# EAGLE design TrackerMini_V2 (EAGLE 9.6.2)
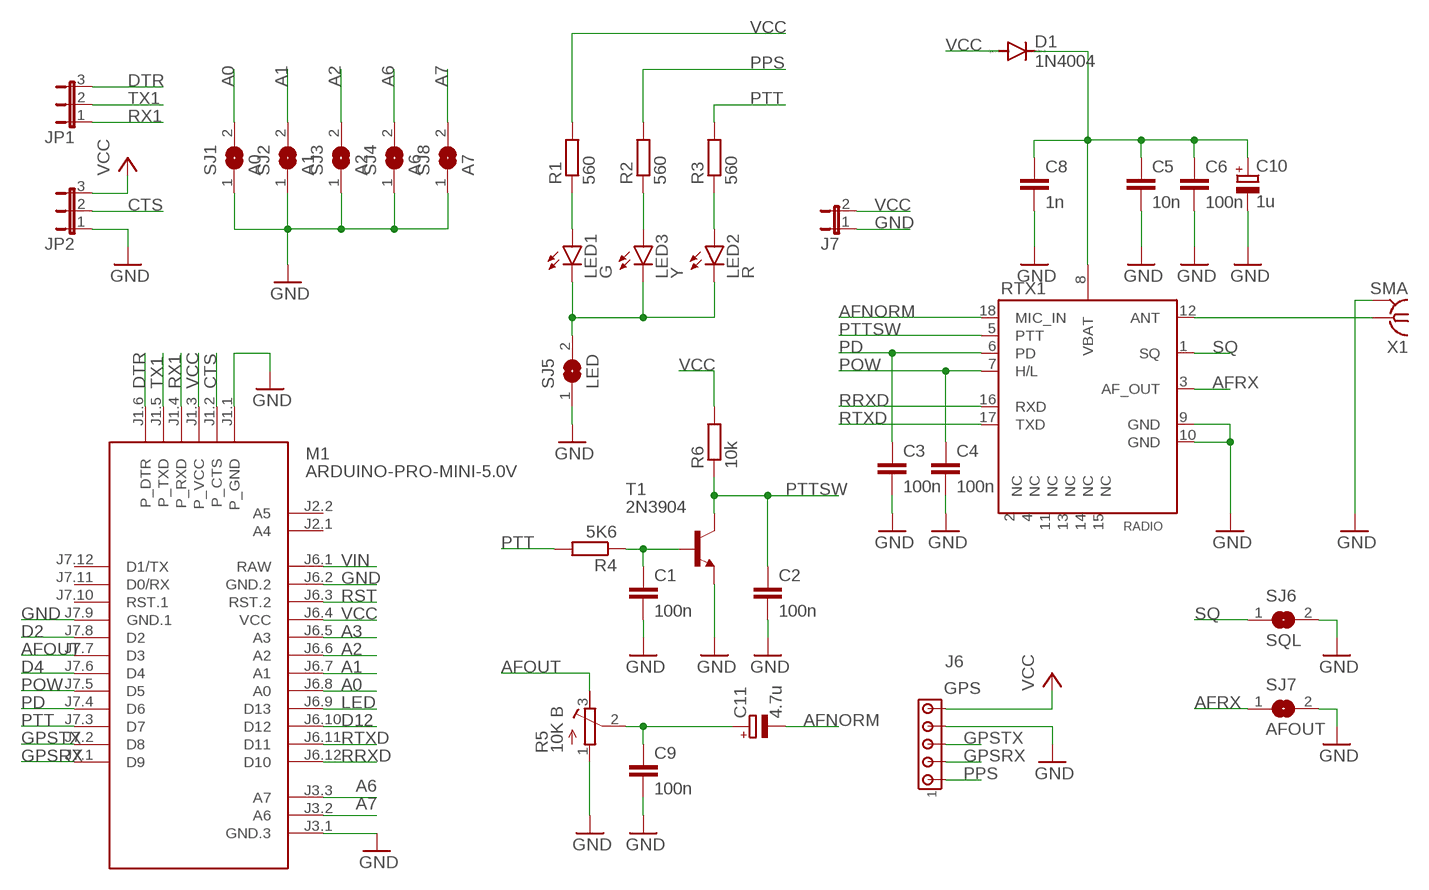
[diagram p0: schematic, sheet 1]

## Parts
C1  100n  C-EU025-025X050  [C025-025X050]
C2  100n  C-EU025-025X050  [C025-025X050]
C3  100n  C-EU025-025X050  [C025-025X050]
C4  100n  C-EU025-025X050  [C025-025X050]
C5  10n  C-EU025-025X050  [C025-025X050]
C6  100n  C-EU025-025X050  [C025-025X050]
C8  1n  C-EU025-025X050  [C025-025X050]
C9  100n  C-EU025-025X050  [C025-025X050]
C10  1u  CPOL-EUE2-5  [E2-5]
C11  4.7u  CPOL-EUE2-5  [E2-5]
D1  1N4004  [DO41-10]
J6  GPS  MTA05-100  [10X05MTA]
J7  JP1E  [JP1]
JP1  JP2E  [JP2]
JP2  JP2E  [JP2]
LED1  G  TLLG4400  [LED3MM]
LED2  R  TLLR4400  [LED3MM]
LED3  Y  TLLY4400  [LED3MM]
M1  ARDUINO-PRO-MINI-5.0V  [ARDUINO-PRO-MINI]
R1  560  R-EU_0204/7  [0204/7]
R2  560  R-EU_0204/7  [0204/7]
R3  560  R-EU_0204/7  [0204/7]
R4  5K6  R-EU_0204/7  [0204/7]
R5  10K B  R-TRIMM64W  [RTRIM64W]
R6  10k  R-EU_0204/7  [0204/7]
RTX1  RADIO  DRA818A  [DRA818A]
SJ1  A0  SJ  [SJ]
SJ2  A1  SJ  [SJ]
SJ3  A2  SJ  [SJ]
SJ4  A6  SJ  [SJ]
SJ5  LED  SJ  [SJ]
SJ6  SQL  SJW  [SJW]
SJ7  AFOUT  SJW  [SJW]
SJ8  A7  SJ  [SJ]
T1  2N3904  [TO92]
X1  SMA  SMA-142-0701-801/806  [J502-ND-142-0701-801/806]

## Nets
A0: M1.J6.8(A0) SJ1.2
A1: M1.J6.7(A1) SJ2.2
A2: M1.J6.6(A2) SJ3.2
A3: M1.J6.5(A3)
A6: M1.J3.3(A7) SJ4.2
A7: M1.J3.2(A6) SJ8.2
AFNORM: C11.- RTX1.18(MIC_IN)
AFOUT: M1.J7.7(D3) R5.3(E)
AFRX: RTX1.3(AF_OUT) SJ7.1
CTS: JP2.2 M1.J1.2(P_CTS)
D2: M1.J7.8(D2)
D4: M1.J7.6(D4)
D12: M1.J6.10(D12)
DTR: JP1.3 M1.J1.6(P_DTR)
GND: C1.2 C2.2 C3.2 C4.2 C5.2 C6.2 C8.2 C9.2 C10.- J6.4 J7.1 JP2.1 M1.J1.1(P_GND) M1.J3.1(GND.3) M1.J6.2(GND.2) M1.J7.9(GND.1) R5.1(A) RTX1.9(GND) RTX1.10(GND) SJ1.1 SJ2.1 SJ3.1 SJ4.1 SJ5.1 SJ6.2 SJ7.2 SJ8.1 T1.3(E) X1.G@1 X1.G@2 X1.G@3 X1.G@4
GPSRX: J6.2 M1.J7.1(D9)
GPSTX: J6.3 M1.J7.2(D8)
LED: M1.J6.9(D13)
N$1: LED1.A R1.1
N$2: LED3.A R2.1
N$3: LED2.A R3.1
N$4: LED1.K(C) LED2.K(C) LED3.K(C) SJ5.2
N$5: RTX1.12(ANT) X1.1
N$6: C1.1 R4.1 T1.2(B)
N$7: C9.1 C11.+ R5.2(S)
N$8: C5.1 C6.1 C8.1 C10.+ D1.C RTX1.8(VBAT)
PD: C3.1 M1.J7.4(D6) RTX1.6(PD)
POW: C4.1 M1.J7.5(D5) RTX1.7(H/L)
PPS: J6.1 R2.2
PTT: M1.J7.3(D7) R3.2 R4.2
PTTSW: C2.1 R6.1 RTX1.5(PTT) T1.1(C)
RRXD: M1.J6.12(D10) RTX1.16(RXD)
RST: M1.J6.3(RST.2)
RTXD: M1.J6.11(D11) RTX1.17(TXD)
RX1: JP1.1 M1.J1.4(P_RXD)
SQ: RTX1.1(SQ) SJ6.1
TX1: JP1.2 M1.J1.5(P_TXD)
VCC: D1.A J6.5 J7.2 JP2.3 M1.J1.3(P_VCC) M1.J6.4(VCC) R1.2 R6.2
VIN: M1.J6.1(RAW)
Unconnected: M1.J2.1(A4) M1.J2.2(A5) M1.J7.10(RST.1) M1.J7.11(D0/RX) M1.J7.12(D1/TX) RTX1.2(NC) RTX1.4(NC) RTX1.11(NC) RTX1.13(NC) RTX1.14(NC) RTX1.15(NC)

## Library data of the parts
C1-C6 C8 C9 = rcl:C-EU: CAPACITOR, European symbol; SPICEPREFIX: C
C10 C11 = rcl:CPOL-EU: POLARIZED CAPACITOR, European symbol; SPICEPREFIX: C
D1 = diode:1N4004: DIODE general purpose rectifier, 1 A
J6 = con-amp:MTA05-100: AMP connector
J7 = jumper:JP1E: JUMPER
JP1 JP2 = jumper:JP2E: JUMPER
LED1 = led:TLLG4400: Low Current (2mA) LED 3 mm Tinted Diffused Package color GREEN Source: Data sheet <http://www.farnell.com/datasheets/391098.pdf>; MF: VISHAY SEMICONDUCTOR; OC_FARNELL: 1612435
LED2 = led:TLLR4400: Low Current (2mA) LED 3 mm Tinted Diffused Package color RED Source: Data sheet <http://www.farnell.com/datasheets/391100.pdf>; MF: VISHAY SEMICONDUCTOR; OC_FARNELL: 1612437
LED3 = led:TLLY4400: Low Current (2mA) LED 3 mm Tinted Diffused Package color YELLOW Source: Data sheet <http://www.farnell.com/datasheets/391098.pdf>; MF: VISHAY SEMICONDUCTOR; OC_FARNELL: 1612439
M1 = diy-modules:ARDUINO-PRO-MINI-*: Arduino Pro Mini and compatible devices More details available here: https://www.arduino.cc/en/Main/ArduinoBoardProMini Click here to find device on ebay.com <http://www.ebay.com/sch/arduino+pro+mini>
R1-R4 R6 = rcl:R-EU_: RESISTOR, European symbol; SPICEPREFIX: R
R5 = rcl:R-TRIMM: Trimm resistor; SPICEMODEL: X; SPICEPREFIXL: POT
RTX1 = dorji:DRA818A
SJ1-SJ8 = jumper:SJ: SMD solder JUMPER
T1 = transistor:2N3904: NPN TRANSISTOR
X1 = con-coax:SMA-: SMA 50 Ohm End Launch Jack Receptacle - Round Contact Johnson Components Source: www.johnsoncomponents.com .. J502-ND.pdf; MF: JOHNSON COMPONENTS; MPN: 142-0701-801; OC_FARNELL: 1608592; OC_NEWARK: 90F2624

## Board
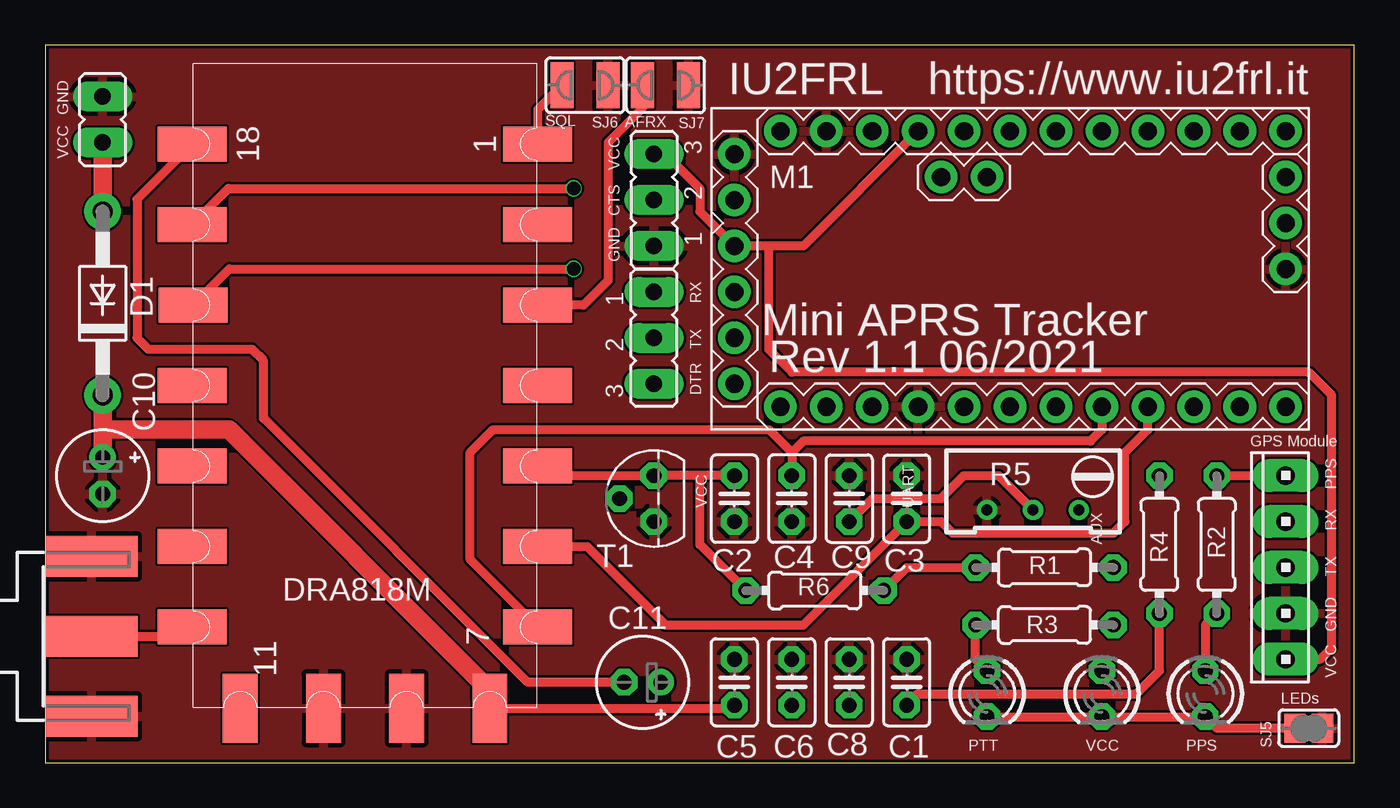
[diagram p1: board, top side]
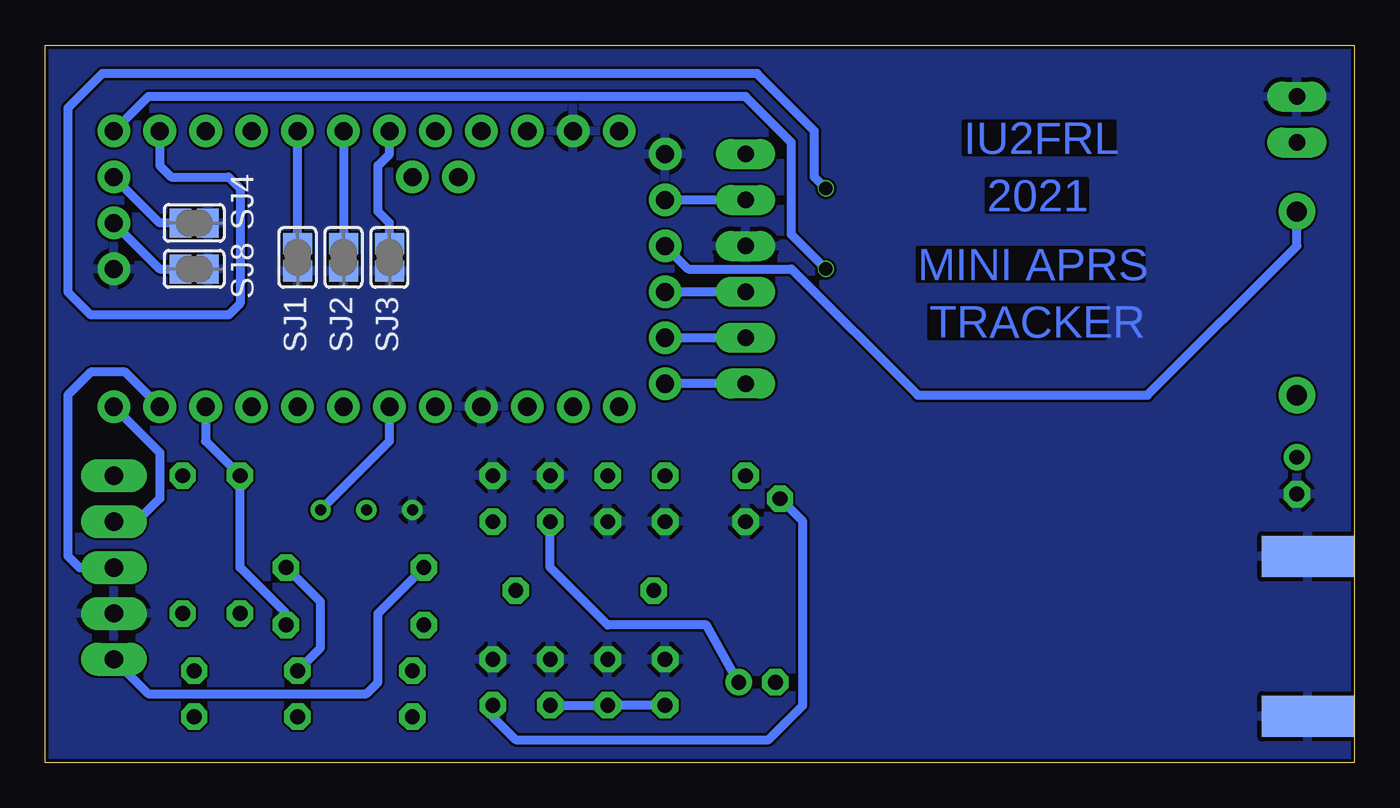
[diagram p2: board, bottom side, seen from below]

Size 72.37 x 39.68 mm. Coordinates in mm from the lower left corner, seen from the top.
Outline: 0,0 72.37,0 72.37,39.68 0,39.68 0,0
Copper layers (1*16): Top 0.035mm / dielectric 1.6mm / Bottom 0.035mm
Design rules "jlcpcb-2layers *": minimum track width 5mil, minimum drill 0.3mm, track to track 5mil, track to pad 5mil, pad to pad 5mil, via to via 5mil, smd to smd 5mil, copper to edge 0.2mm, drill to drill 6mil, minimum pad ring 10mil, minimum via ring 3mil, stop-mask expansion 4mil, vias tented up to drill 0mil, thermal gap 10mil

### Footprints (pad centres in the part's own frame; a part is rotated, then mirrored left to right if it is on the bottom)
C025-025X050 = drill 0.813 octagon: 1 -1.27,0; 2 1.27,0
E2-5 = drill 0.813 pad 1.27: + -1.016,0 | drill 0.813 pad 1.27 octagon: - 1.016,0
DO41-10 = drill 1.118: A 5.08,0; C -5.08,0
10X05MTA = drill 1.016 long: 1 5.08,0; 2 2.54,0; 3 0,0; 4 -2.54,0; 5 -5.08,0
JP1 = drill 0.914 long: 1 0,-1.27; 2 0,1.27
JP2 = drill 0.914 long: 1 -2.54,0; 2 0,0; 3 2.54,0
LED3MM = drill 0.813 octagon: A -1.27,0; K 1.27,0
ARDUINO-PRO-MINI = drill 1: J1.1 -15.24,6.35; J1.2 -15.24,3.81; J1.3 -15.24,1.27; J1.4 -15.24,-1.27; J1.5 -15.24,-3.81; J1.6 -15.24,-6.35; J2.1 -1.27,5.08; J2.2 -3.81,5.08; J3.1 15.24,0; J3.2 15.24,2.54; J3.3 15.24,5.08; J6.1 -12.7,7.62; J6.2 -10.16,7.62; J6.3 -7.62,7.62; J6.4 -5.08,7.62; J6.5 -2.54,7.62; J6.6 0,7.62; J6.7 2.54,7.62; J6.8 5.08,7.62; J6.9 7.62,7.62; J6.10 10.16,7.62; J6.11 12.7,7.62; J6.12 15.24,7.62; J7.1 15.24,-7.62; J7.2 12.7,-7.62; J7.3 10.16,-7.62; J7.4 7.62,-7.62; J7.5 5.08,-7.62; J7.6 2.54,-7.62; J7.7 0,-7.62; J7.8 -2.54,-7.62; J7.9 -5.08,-7.62; J7.10 -7.62,-7.62; J7.11 -10.16,-7.62; J7.12 -12.7,-7.62
0204/7 = drill 0.813 octagon: 1 -3.81,0; 2 3.81,0
RTRIM64W = drill 0.61: 1 1.27,-2.54; 2 1.27,0; 3 1.27,2.54
DRA818A = smd 3.81 x 1.93: 1 -9.45,-13.25; 2 -9.45,-8.8; 3 -9.45,-4.35; 4 -9.45,0.1; 5 -9.45,4.55; 6 -9.45,9; 7 -9.45,13.45; 12 9.65,13.45; 13 9.65,9; 14 9.65,4.55; 15 9.65,0.1; 16 9.6,-4.35; 17 9.65,-8.8; 18 9.65,-13.25 | smd 1.93 x 3.81: 8 -6.8,17.95; 9 -2.2,17.95; 10 2.4,17.95; 11 7,17.95
SJ = smd 1.168 x 1.6: 1 -0.762,0; 2 0.762,0
SJW = smd 1.27 x 2.54: 1 -1.27,0; 2 1.27,0
TO92 = drill 0.813 octagon: 1 1.27,0; 2 0,1.905; 3 -1.27,0
J502-ND-142-0701-801/806 = smd 5.08 x 2.286: 1 2.565,0; G@1 2.565,4.42; G@2 2.565,-4.42 | smd 5.08 x 2.286 bottom: G@3 2.565,4.42; G@4 2.565,-4.42

### Placement (x,y rotation side)
C1  47.62,4.45 90 top
C2  38.1,14.61 270 top
C3  47.62,14.61 90 top
C4  41.28,14.61 270 top
C5  38.1,4.45 90 top
C6  41.28,4.45 90 top
C8  44.45,4.45 90 top
C9  44.45,14.61 90 top
C10  3.18,15.88 270 top
C11  33.02,4.45 180 top
D1  3.18,25.4 90 top
J6  68.58,10.79 90 top
J7  3.18,35.56 180 top
JP1  33.66,23.5 270 top
JP2  33.66,31.11 90 top
LED1  58.42,3.81 270 top
LED2  52.07,3.81 270 top
LED3  64.14,3.81 270 top
M1  53.34,27.31 0 top
R1  55.25,10.79 180 top
R2  64.77,12.07 90 top
R3  55.25,7.62 0 top
R4  61.59,12.07 90 top
R5  54.61,15.24 270 top
R6  42.55,9.53 0 top
RTX1  17.78,20.96 180 top
SJ1  58.42,27.94 90 bottom
SJ2  55.88,27.94 90 bottom
SJ3  53.34,27.94 90 bottom
SJ4  64.14,29.85 180 bottom
SJ5  69.85,1.91 180 top
SJ6  29.84,37.47 0 top
SJ7  34.29,37.47 0 top
SJ8  64.14,27.31 180 bottom
T1  33.66,14.61 90 top
X1  0,6.99 0 top

### Tracks (layer width: path | path; a pad name or v marks a point on that pad's centre or on a via)
A0
  Bottom 0.508: SJ1.2 M1.J6.8
A1
  Bottom 0.508: M1.J6.7 SJ2.2
A2
  Bottom 0.508: SJ3.2 53.34,29.85 53.97,30.48 53.97,33.02 53.34,33.66 M1.J6.6
A6
  Bottom 0.508: SJ4.2 66.04,29.85 M1.J3.3
A7
  Bottom 0.508: M1.J3.2 66.04,27.31 SJ8.2
AFNORM
  Top 0.508: RTX1.18 5.08,31.16 5.08,23.5 5.72,22.86 11.43,22.86 12.06,22.23 12.06,19.05 26.67,4.45 C11.-
AFOUT
  Bottom 0.508: R5.3 53.34,17.78 M1.J7.7
AFRX
  Top 0.508: SJ7.1 33.02,36.2 31.11,34.29 31.11,26.67 29.75,25.31 RTX1.3
CTS
  Bottom 0.508: JP2.2 M1.J1.2
DTR
  Bottom 0.508: JP1.3 M1.J1.6
GND
  pour Bottom: 0,39.37 0,0 72.39,0 72.39,39.37
  pour Top: 0,39.37 0,0 72.39,0 72.39,39.37
GPSRX
  Bottom 0.508: M1.J7.1 66.04,17.14 66.04,14.61 67.31,13.34 J6.2
GPSTX
  Bottom 0.508: M1.J7.2 67.95,21.59 69.85,21.59 71.12,20.32 71.12,11.43 70.48,10.79 J6.3
N$1
  Bottom 0.508: LED1.A 57.15,6.35 57.15,8.89 R1.1
N$2
  Top 0.508: R2.1 64.14,7.62 LED3.A
N$3
  Top 0.508: LED2.A 51.44,5.71 R3.1
N$4
  Top 0.508: LED2.K LED1.K LED3.K 64.77,1.91 SJ5.2
N$5
  Top 0.508: X1.1 7.61,6.99 RTX1.12
N$6
  Top 0.508: C1.1 48.26,3.81 60.33,3.81 61.59,5.08 R4.1
  Bottom 0.508: C1.1 47.62,2.54 46.36,1.27 32.39,1.27 30.48,3.18 30.48,13.34 T1.2
N$7
  Top 0.508: C9.1 45.72,14.61 49.53,14.61 50.8,15.88 52.7,15.88 R5.2
  Bottom 0.508: C11.+ 35.81,7.62 41.28,7.62 44.45,10.79 C9.1
N$8
  Top 0.508: 24.75,3.18 RTX1.8 37.93,3 C5.1
  Top 1.016: C10.+ 3.18,18.42 | 3.18,18.42 D1.C | RTX1.8 24.13,3.46 24.13,4.45 10.16,18.42 3.18,18.42
  Bottom 0.508: C5.1 C6.1 C8.1
PD
  Top 0.508: M1.J7.4 60.96,18.42 59.69,17.14 59.69,13.34 59.06,12.7 50.17,12.7 49.53,13.34 C3.1 41.91,7.62 34.29,7.62 29.95,11.96 RTX1.6
POW
  Top 0.508: M1.J7.5 58.42,18.42 57.78,17.78 41.91,17.78 41.28,17.14 | 41.28,17.14 C4.1 | RTX1.7 23.5,11.24 23.5,17.14 24.77,18.42 40,18.42 41.28,17.14
PPS
  Top 0.508: R2.2 J6.1
PTT
  Bottom 0.508: M1.J7.3 63.5,17.78 R4.2 61.59,10.79 59.06,8.25 R3.2
PTTSW
  Top 0.508: C2.1 36.2,15.88 | 36.2,15.88 T1.1 27.76,15.88 RTX1.5 | R6.1 36.2,12.07 36.2,15.88
RRXD  (via drill 0.75)
  Top 0.508: RTX1.16 10.18,27.31 v29.21,27.31
  Bottom 0.508: v29.21,27.31 31.11,29.21 31.11,34.29 33.66,36.83 66.67,36.83 M1.J6.12
RTXD  (via drill 0.75)
  Top 0.508: RTX1.17 10.12,31.75 v29.21,31.75
  Bottom 0.508: v29.21,31.75 29.84,32.39 29.84,34.93 33.02,38.1 69.22,38.1 71.12,36.2 71.12,26.04 69.85,24.77 62.23,24.77 61.59,25.4 61.59,31.75 62.23,32.39 65.41,32.39 66.04,33.02 M1.J6.11
RX1
  Bottom 0.508: JP1.1 M1.J1.4
SQ
  Top 0.508: SJ6.1 27.23,36.12 RTX1.1
TX1
  Bottom 0.508: JP1.2 M1.J1.5
VCC
  Top 0.508: R6.2 47.62,10.79 R1.2 | JP2.3 34.29,33.66 36.2,31.75 36.2,30.48 M1.J1.3 40,28.57 | M1.J6.4 41.91,28.57 40,28.57 | J6.5 70.48,5.71 71.12,6.35 71.12,20.32 69.85,21.59 41.28,21.59 40,22.86 40,28.57
  Top 1.016: D1.A J7.2
  Bottom 0.508: J6.5 66.67,3.81 54.61,3.81 53.97,4.45 53.97,8.25 R1.2 | M1.J1.3 36.83,27.31 31.11,27.31 24.13,20.32 11.43,20.32 3.18,28.57 D1.A

### Text on the board
Bottom: IU2FRL | 2021 | MINI APRS | TRACKER
tNames: IU2FRL | https://www.iu2frl.it | GND | SQL | AFRX | VCC | VCC | CTS | GND | RX | Mini APRS Tracker | TX | Rev 1.1 06/2021 | DTR | GPS Module | PPS | VCC | UART | RX | AUX | TX | GND | VCC | LEDs | PTT | VCC | PPS